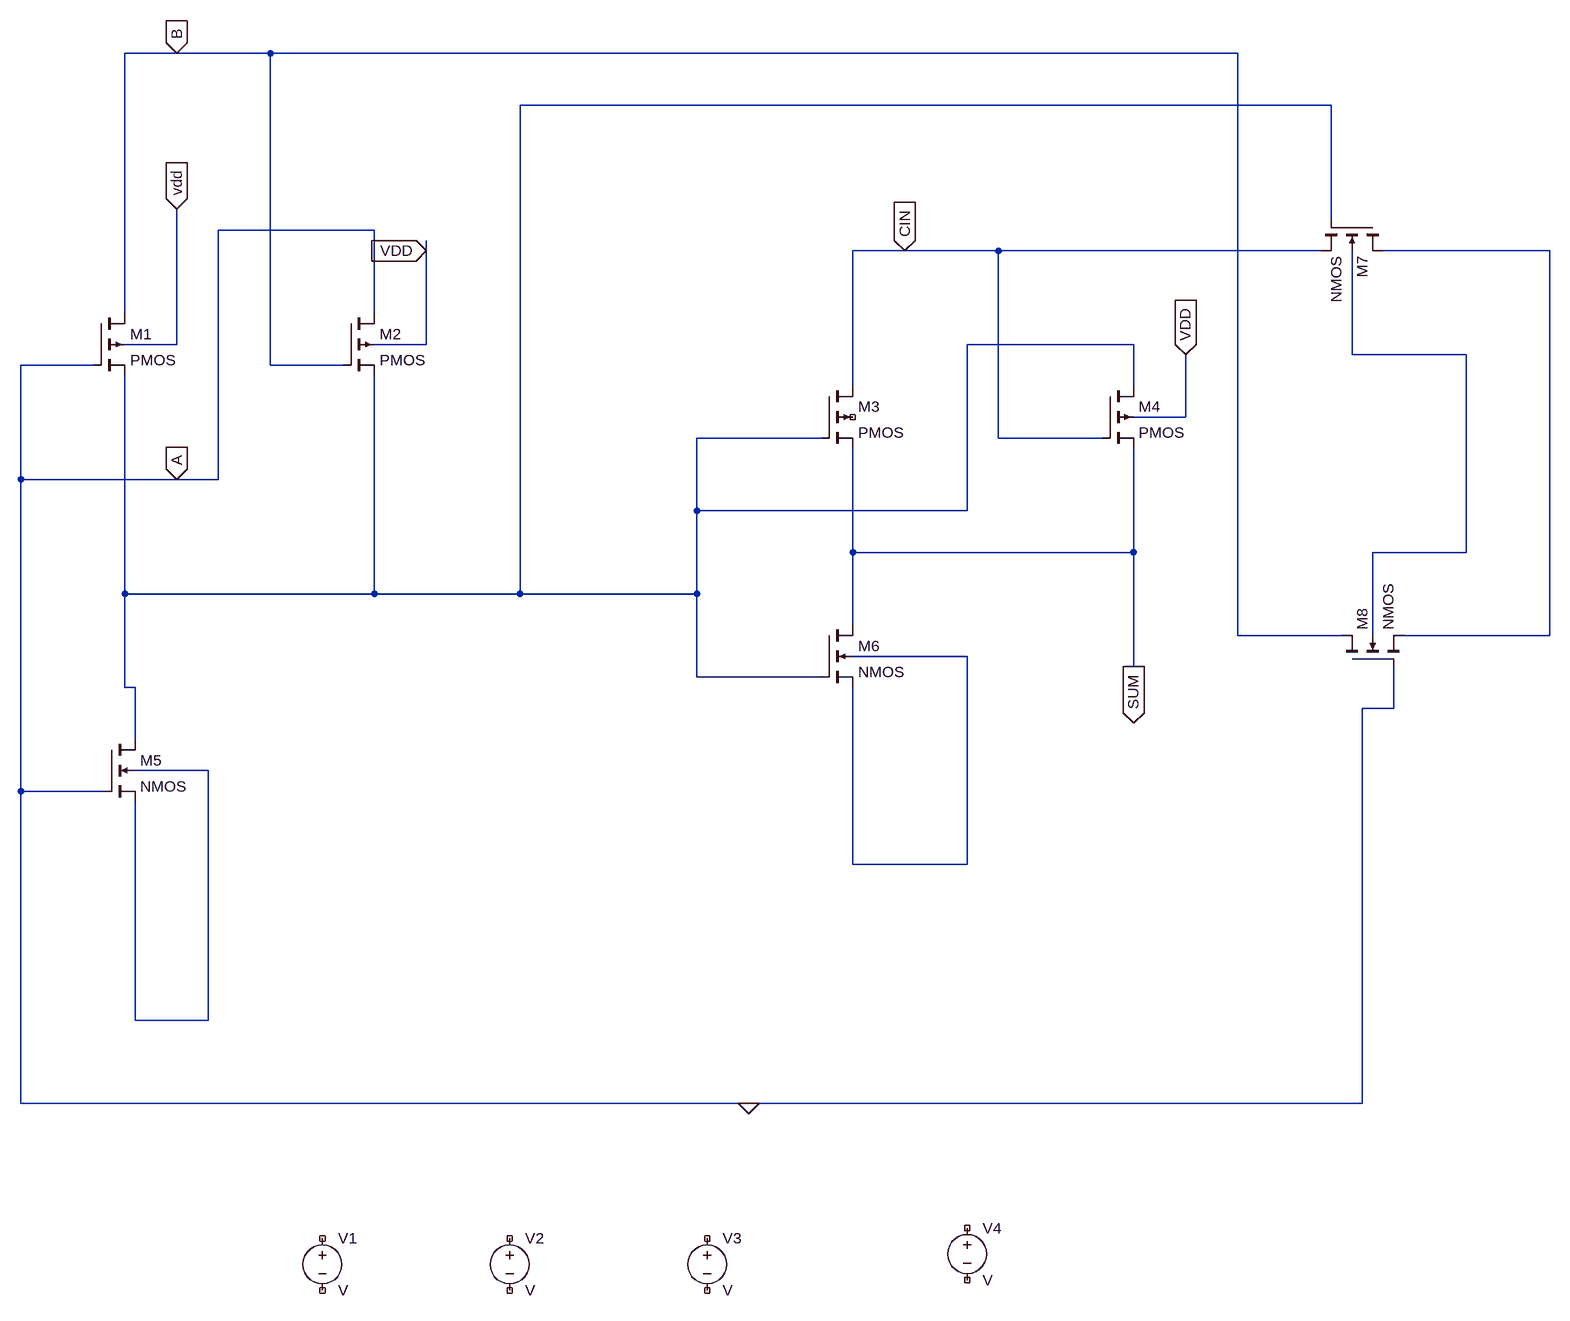
[diagram p0: schematic Draft6.asc]
Draft6.asc, the LTspice schematic file:
Version 4
SHEET 1 2388 1648
WIRE 272 -272 192 -272
WIRE 416 -272 272 -272
WIRE 1904 -272 416 -272
WIRE 2048 -192 800 -192
WIRE 2048 -16 2048 -192
WIRE 576 0 336 0
WIRE 656 32 656 16
WIRE 1392 32 1312 32
WIRE 1536 32 1392 32
WIRE 2032 32 1536 32
WIRE 2384 32 2128 32
WIRE 192 128 192 -272
WIRE 576 128 576 0
WIRE 272 176 272 -32
WIRE 272 176 192 176
WIRE 656 176 656 32
WIRE 656 176 576 176
WIRE 1744 176 1488 176
WIRE 2080 192 2080 32
WIRE 2256 192 2080 192
WIRE 144 208 32 208
WIRE 416 208 416 -272
WIRE 528 208 416 208
WIRE 1312 240 1312 32
WIRE 1744 240 1744 176
WIRE 1824 288 1824 192
WIRE 1824 288 1744 288
WIRE 1264 320 1072 320
WIRE 1536 320 1536 32
WIRE 1696 320 1536 320
WIRE 32 384 32 208
WIRE 272 384 32 384
WIRE 336 384 336 0
WIRE 336 384 272 384
WIRE 1072 432 1072 320
WIRE 1488 432 1488 176
WIRE 1488 432 1072 432
WIRE 1312 496 1312 336
WIRE 1744 496 1744 336
WIRE 1744 496 1312 496
WIRE 2256 496 2256 192
WIRE 2256 496 2112 496
WIRE 192 560 192 224
WIRE 576 560 576 224
WIRE 576 560 192 560
WIRE 800 560 800 -192
WIRE 800 560 576 560
WIRE 1072 560 1072 432
WIRE 1072 560 800 560
WIRE 1312 608 1312 496
WIRE 1904 624 1904 -272
WIRE 2064 624 1904 624
WIRE 2112 624 2112 496
WIRE 2384 624 2384 32
WIRE 2384 624 2160 624
WIRE 1488 656 1312 656
WIRE 1744 672 1744 496
WIRE 1072 688 1072 560
WIRE 1264 688 1072 688
WIRE 192 704 192 560
WIRE 208 704 192 704
WIRE 2144 736 2144 672
WIRE 2144 736 2096 736
WIRE 208 784 208 704
WIRE 320 832 208 832
WIRE 32 864 32 384
WIRE 160 864 32 864
WIRE 1312 976 1312 704
WIRE 1488 976 1488 656
WIRE 1488 976 1312 976
WIRE 208 1216 208 880
WIRE 320 1216 320 832
WIRE 320 1216 208 1216
WIRE 32 1344 32 864
WIRE 1152 1344 32 1344
WIRE 2096 1344 2096 736
WIRE 2096 1344 1152 1344
FLAG 272 -32 vdd
IOPIN 272 -32 In
FLAG 272 384 A
IOPIN 272 384 In
FLAG 272 -272 B
IOPIN 272 -272 In
FLAG 656 32 VDD
IOPIN 656 32 In
FLAG 1744 672 SUM
IOPIN 1744 672 Out
FLAG 1824 192 VDD
IOPIN 1824 192 In
FLAG 1392 32 CIN
IOPIN 1392 32 In
FLAG 1152 1344 0
SYMBOL pmos4 144 128 R0
SYMATTR InstName M1
SYMBOL pmos4 528 128 R0
SYMATTR InstName M2
SYMBOL pmos4 1264 240 R0
SYMATTR InstName M3
SYMBOL pmos4 1696 240 R0
SYMATTR InstName M4
SYMBOL nmos4 160 784 R0
SYMATTR InstName M5
SYMBOL nmos4 1264 608 R0
SYMATTR InstName M6
SYMBOL nmos4 2128 -16 R90
SYMATTR InstName M7
SYMBOL nmos4 2064 672 R270
SYMATTR InstName M8
SYMBOL voltage 496 1536 R0
SYMATTR InstName V1
SYMBOL voltage 784 1536 R0
SYMATTR InstName V2
SYMBOL voltage 1088 1536 R0
SYMATTR InstName V3
SYMBOL voltage 1488 1520 R0
SYMATTR InstName V4

The netlist it stands for:
* Draft6.asc
M1 B 0 N001 vdd PMOS
M2 0 B N001 vdd PMOS
M3 CIN N001 SUM NC_01 PMOS
M4 N001 CIN SUM vdd PMOS
M5 N001 0 N005 N005 NMOS
M6 SUM N001 N004 N004 NMOS
M7 N002 N001 CIN N003 NMOS
M8 B 0 N002 N003 NMOS
V1 NC_02 NC_03 V
V2 NC_04 NC_05 V
V3 NC_06 NC_07 V
V4 NC_08 NC_09 V
.model NMOS NMOS
.model PMOS PMOS
.lib standard.mos
.backanno
.end